# Altium project Quectel M66.PrjPcb
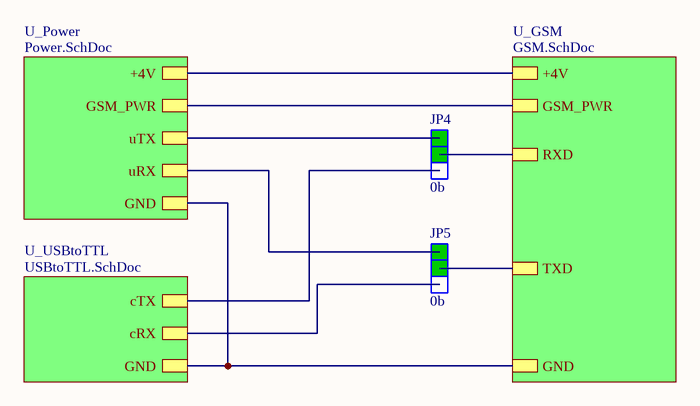
[diagram p0: Main.SchDoc]
Revision: 1.2; Project_Name: Quectel M66; CompanyName: github.com/aKaReZa75
4 sheets, 88 parts. Net scope: strictly hierarchical (ports join the sheet entries above them; power ports are local).
Board file: PCB.PcbDoc
Sheets:
  Main.SchDoc
    U_Power = Power.SchDoc
    U_GSM = GSM.SchDoc
    U_USBtoTTL = USBtoTTL.SchDoc

## Sheet Main.SchDoc: Main
size A4; SheetNumber: 2; SheetTotal: 4

### Parts
JP4  0b  [jumper selector]
JP5  0b  [jumper selector]

### Sub-sheets
U_GSM = GSM.SchDoc: +4V, GND, GSM_PWR, TXD, RXD
U_Power = Power.SchDoc: uRX, uTX, +4V, GND, GSM_PWR
U_USBtoTTL = USBtoTTL.SchDoc: GND, cTX, cRX

### Nets
+4: sheet U_Power/+4V, sheet U_GSM/+4V
GND: sheet U_Power/GND, sheet U_GSM/GND, sheet U_USBtoTTL/GND
cRX: JP5.3 ; sheet U_USBtoTTL/cRX
cTX: JP4.3 ; sheet U_USBtoTTL/cTX
GSM_PWR: sheet U_Power/GSM_PWR, sheet U_GSM/GSM_PWR
RXD: JP4.2 ; sheet U_GSM/RXD
TXD: JP5.2 ; sheet U_GSM/TXD
uRX: JP5.1 ; sheet U_Power/uRX
uTX: JP4.1 ; sheet U_Power/uTX

### Notes on the sheet
- Title:
- Project:
- Drawn by:
- Revision:
- Hossein Bagheri
- Company:
- Sheet
- of

### Library data of the parts
JP4 JP5 = SW_Other_JSelector_THT: Jumper Selector; Rating: Rating?; Inflow: 5145; Validation: Valid; Package: Dip; Type: Selector; Value: 0b

## Sheet Power.SchDoc: Power
size A4; SheetNumber: 3; SheetTotal: 4
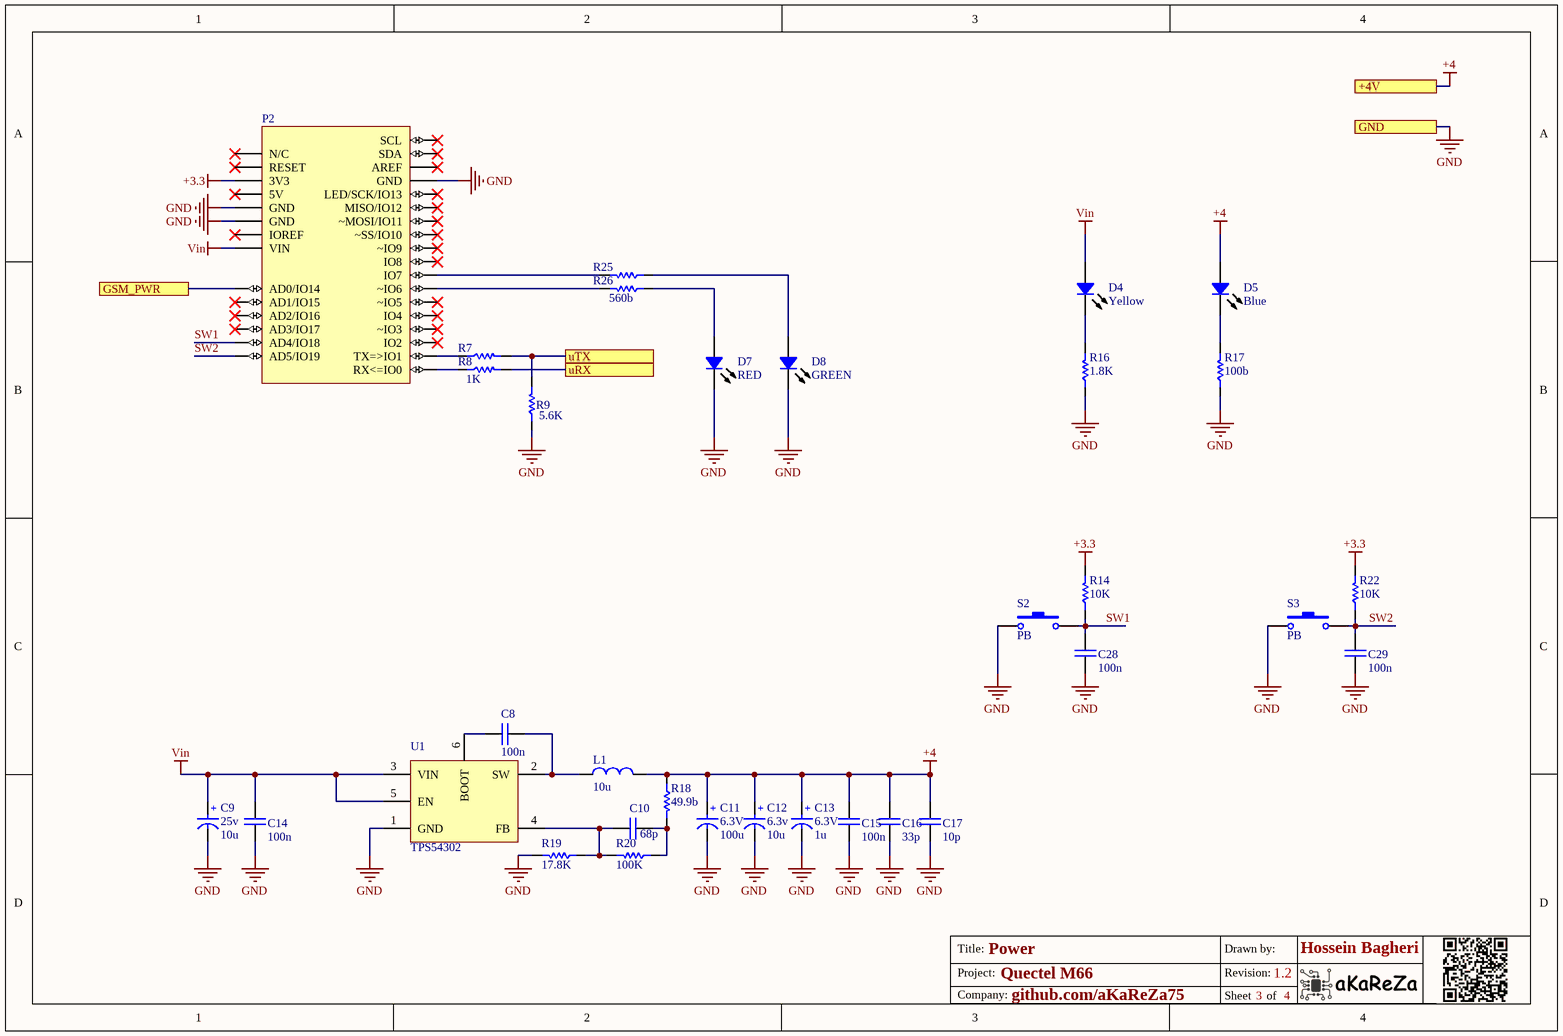
[diagram p1: Power.SchDoc]

### Parts
C8  100n  [CAP 0805/2012]
C9  Rating: 25v  [SMT_C_Tantalum_B]  (hidden comment: 10u)
C10  68p  [CAP 0805/2012]
C11  Rating: 6.3V  [SMT_C_Tantalum_C]  (hidden comment: 100u)
C12  Rating: 6.3v  [SMT_C_Tantalum_A]  (hidden comment: 10u)
C13  Rating: 6.3V  [SMT_C_Tantalum_A]  (hidden comment: 1u)
C14  100n  [CAP 1206/3216]
C15  100n  [CAP 1206/3216]
C16  33p  [CAP 1206/3216]
C17  10p  [CAP 1206/3216]
C28  100n  [CAP 0805/2012]
C29  100n  [CAP 0805/2012]
D4  Yellow  [LED 0805/2012 YELLOW]
D5  Blue  [LED 0805/2012 BLUE]
D7  RED  [LED 0805/2012 RED]
D8  GREEN  [LED 0805/2012 GREEN]
L1  10u  [L_7]
P2  UNO  [Arduino_uno_S_3]  (value not drawn)  (no BOM)
R7  1K  [RES 0805 (2012X06L)]  (value not drawn)
R8  1K  [RES 0805 (2012X06L)]
R9  5.6K  [RES 0805 (2012X06L)]
R14  10K  [RES 0805 (2012X06L)]
R16  1.8K  [RES 0805 (2012X06L)]
R17  100b  [RES 0805 (2012X06L)]
R18  49.9b  [RES 0805 (2012X06L)]
R19  17.8K  [RES 0805 (2012X06L)]
R20  100K  [RES 0805 (2012X06L)]
R22  10K  [RES 0805 (2012X06L)]
R25  560b  [RES 0805 (2012X06L)]  (value not drawn)
R26  560b  [RES 0805 (2012X06L)]
S2  PB  [SW_PB_SMD_2PIN_SPST_6X3X2]
S3  PB  [SW_PB_SMD_2PIN_SPST_6X3X2]
U1  TPS54302  [TPS54302]

### Ports
+4V, GND, GSM_PWR, uRX, uTX

### Nets
+3.3: P2.4(3V3) R14.2 R22.2
+4: C11.1(+) C12.1(+) C13.1(+) C15.1 C16.1 C17.1 D5.1 L1.2 R18.1 ; port +4V
GND: C9.2(-) C11.2(-) C12.2(-) C13.2(-) C14.2 C15.2 C16.2 C17.2 C28.2 C29.2 D7.2 D8.2 P2.6(GND) P2.7(GND) P2.29(GND) R9.1 R16.1 R17.1 R19.2 S2.2 S3.2 U1.1(GND) ; port GND
Vin: C9.1(+) C14.1 D4.1 P2.8(VIN) U1.3(VIN) U1.5(EN)
GSM_PWR: P2.9(AD0/IO14) ; port GSM_PWR
SW1: C28.1 P2.13(AD4/IO18) R14.1 S2.1
SW2: C29.1 P2.14(AD5/IO19) R22.1 S3.1
uRX: R8.2 ; port uRX
uTX: R7.2 R9.2 ; port uTX
NetC8_1: C8.1 U1.6(BOOT)
NetC8_2: C8.2 L1.1 U1.2(SW)
NetC10_1: C10.1 R19.1 R20.2 U1.4(FB)
NetC10_2: C10.2 R18.2 R20.1
NetD4_2: D4.2 R16.2
NetD5_2: D5.2 R17.2
NetD7_1: D7.1 R26.1
NetD8_1: D8.1 R25.1
NetP2_15: P2.15(RX<=IO0) R8.1
NetP2_16: P2.16(TX=>IO1) R7.1
NetP2_21: P2.21(~IO6) R26.2
NetP2_22: P2.22(IO7) R25.2

Not connected (* = marked no-connect by the designer): P2 1(N/C)* 2(IOREF)* 3(RESET)* 5(5V)* 10(AD1/IO15)* 11(AD2/IO16)* 12(AD3/IO17)* 17(IO2)* 18(~IO3)* 19(IO4)* 20(~IO5)* 23(IO8)* 24(~IO9)* 25(~SS/IO10)* 26(~MOSI/IO11)* 27(MISO/IO12)* 28(LED/SCK/IO13)* 30(AREF)* 31(SDA)* 32(SCL)*

### Notes on the sheet
- Title:
- Project:
- Drawn by:
- Revision:
- Hossein Bagheri
- Company:
- Sheet
- of

### Library data of the parts
C8 C28 C29 = Cap_Multi_SMD_100nF_0805: Bipolar ceramic capacitor SMD; Inflow: inflow?; Type: MultiLayer; Rating: 50V; Validation: Valid; Package: 0805; Value: 100n
C9 C12 = Cap_Tantalum: Tantalum Capacitor,TAJ Series-SMD; Inflow: inflow?; Validation: Valid; Package: Package?; Type: Tantalum; Value: 10u
C10 = Cap_Multi_SMD_0805: Bipolar ceramic capacitor SMD; Inflow: inflow?; Type: MultiLayer; Rating: Rating?; Validation: Valid; Package: 0805; Value: 68p
C11 C13 = Cap_Tantalum: Tantalum Capacitor,TAJ Series-SMD; Inflow: inflow?; Type: Tantalum
  C11: Package: SMD-C; Value: 100u
  C13: Package: SMD-A; Value: 1u
C14 = Cap_Multi_SMD_100nF_1206: Bipolar ceramic capacitor SMD; Type: MultiLayer; Inflow: inflow?; Rating: 50V; Validation: Valid; Package: 1206; Value: 100n
C15 = Cap_Multi_SMD_100nF_1206: Bipolar ceramic capacitor SMD; Type: MultiLayer; Inflow: inflow?; Rating: 50V; Package: 1206; Value: 100n
C16 C17 = Cap_Multi_SMD_1206: Bipolar ceramic capacitor SMD; Inflow: inflow?; Type: MultiLayer; Rating: 50V; Package: 1206
  C16: Value: 33p
  C17: Value: 10p
D4 D5 D7 D8 = Semi_LED_SMD: LED; Inflow: inflow?; Rating: Rating?; Validation: Valid; Package: Package?; Type: LED
  D4: Value: Yellow
  D5: Value: Blue
  D7: Value: RED
  D8: Value: GREEN
L1 = Ind_SMD: Inductor; Inflow: inflow?; Type: Type?; Rating: 3.8A; Validation: Valid; Package: Package?; Value: 10u
P2 = Con_Arduino_UNO_S: Arduino uno slave; Inflow: inflow?; Rating: Rating?; Validation: Valid; Value: UNO; Package: Package?; Type: Type?
R7-R9 R14 R16-R20 R22 R25 R26 = Res_SMD_0805: Resistor; Inflow: inflow?; Rating: 0.125W; Validation: Valid; Package: 0805
  R7 R8: Type: 10%; Value: 1K
  R9: Type: 10%; Value: 5.6K
  R14 R22: Type: 10%; Value: 10K
  R16: Type: 10%; Value: 1.8K
  R17: Type: 10%; Value: 100b
  R18: Type: 1%; Value: 49.9b
  R19: Type: 1%; Value: 17.8K
  R20: Type: 1%; Value: 100K
  R25 R26: Type: 10%; Value: 560b
S2 S3 = SW_PushButton_2_SMD: SMT Tactile ‎Switch; Rating: 2b; Validation: Valid; Inflow: 8260; Type: Vertical; Package: SMD; Value: PB
U1 = IC_Reg_TPS54302: 3'A Synchronous Step-Down Converter; Rating: S; Inflow: inflow?; Validation: Valid; Value: TPS54302; Type: Switching; Package: SOT-23-6

## Sheet GSM.SchDoc: GSM
size A4; SheetNumber: 2; SheetTotal: 4
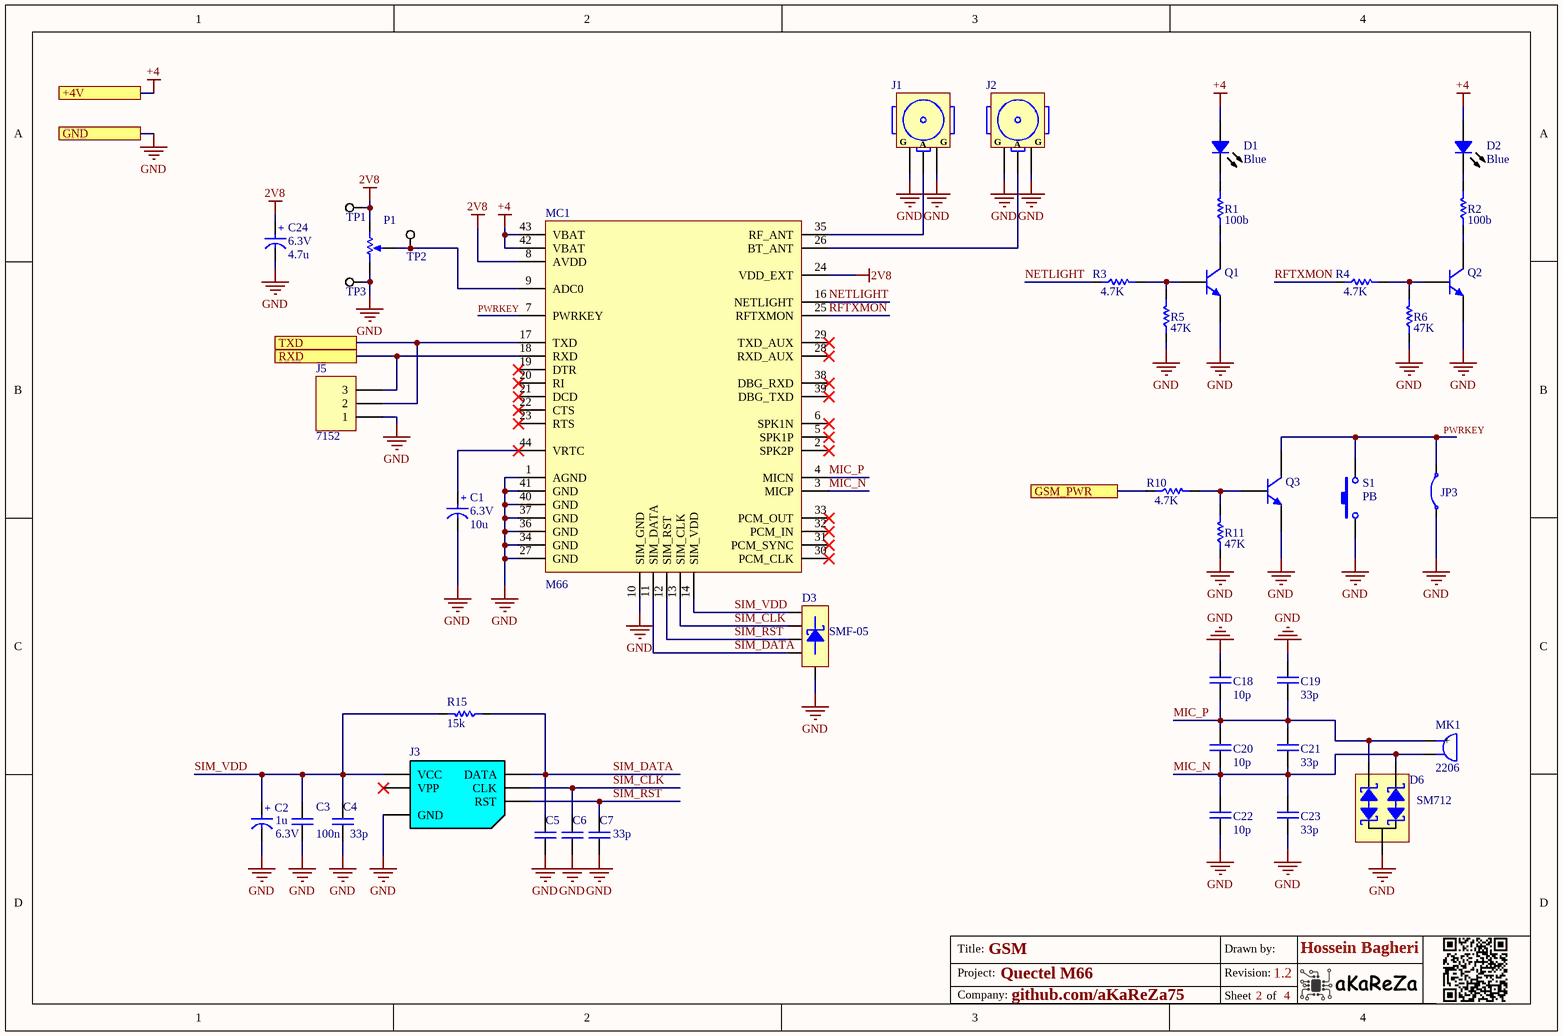
[diagram p2: GSM.SchDoc]

### Parts
C1  Rating: 6.3V  [SMT_C_Tantalum_A]  (hidden comment: 10u)
C2  Rating: 6.3V  [SMT_C_Tantalum_A]  (hidden comment: 1u)
C3  100n  [CAP 0805/2012]
C4  33p  [CAP 0805/2012]
C5  33p  [CAP 0805/2012]  (value not drawn)
C6  33p  [CAP 0805/2012]  (value not drawn)
C7  33p  [CAP 0805/2012]
C18  10p  [CAP 0603/1608]
C19  33p  [CAP 0603/1608]
C20  10p  [CAP 0603/1608]
C21  33p  [CAP 0603/1608]
C22  10p  [CAP 0603/1608]
C23  33p  [CAP 0603/1608]
C24  Rating: 6.3V  [SMT_C_Tantalum_A]  (hidden comment: 4.7u)
D1  Blue  [LED 0805/2012 BLUE]
D2  Blue  [LED 0805/2012 BLUE]
D3  SMF-05  [SC70-5_N]
D6  SM712  [SOT23_M]
J1  U.FL  [IPEX-3x3mm]  (value not drawn)
J2  U.FL  [IPEX-3x3mm]  (value not drawn)
J3  6'Pin  [GCT_SIM8051_Plastik]  (value not drawn)
J5  Inflow: 7152  [HDR_THT_3M_2.54mm]  (hidden comment: 3)
JP3  Jumper  [RESC2012M (0805)]  (value not drawn)
MC1  M66  [m66]
MK1  Inflow: 2206  [mic6]  (hidden comment: Mic)
P1  10K  [Multi turn 01]  (value not drawn)
Q1  NPN  [SOT23_N]  (value not drawn)
Q2  NPN  [SOT23_N]  (value not drawn)
Q3  NPN  [SOT23_N]  (value not drawn)
R1  100b  [RES 0805 (2012X06L)]
R2  100b  [RES 0805 (2012X06L)]
R3  4.7K  [RES 0805 (2012X06L)]
R4  4.7K  [RES 0805 (2012X06L)]
R5  47K  [RES 0805 (2012X06L)]
R6  47K  [RES 0805 (2012X06L)]
R10  4.7K  [RES 0805 (2012X06L)]
R11  47K  [RES 0805 (2012X06L)]
R15  15k  [RES 0805 (2012X06L)]
S1  PB  [SW_PB_SMD_2PIN_SPST_6X3X2]
TP1  TestPoint  [TP_SMD_1x2]  (value not drawn)  (no BOM)
TP2  TestPoint  [TP_SMD_1x2]  (value not drawn)  (no BOM)
TP3  TestPoint  [TP_SMD_1x2]  (value not drawn)  (no BOM)

### Ports
+4V, GND, GSM_PWR, RXD, TXD

### Nets
2V8: C24.1(+) MC1.8(AVDD) MC1.24(VDD_EXT) P1.3 TP1.1(TP)
+4: D1.1 D2.1 MC1.42(VBAT) MC1.43(VBAT) ; port +4V
GND: C1.2(-) C2.2(-) C3.2 C4.2 C5.2 C6.2 C7.2 C18.1 C19.1 C22.2 C23.2 C24.2(-) D3.2(K) D6.3 J1.2(G) J1.3(G) J2.2(G) J2.3(G) J3.5(GND) J5.1 JP3.1 MC1.1(AGND) MC1.10(SIM_GND) MC1.27(GND) MC1.34(GND) MC1.36(GND) MC1.37(GND) MC1.40(GND) MC1.41(GND) P1.1 Q1.2(E) Q2.2(E) Q3.2(E) R5.1 R6.1 R11.1 S1.1 TP3.1(TP) ; port GND
GSM_PWR: R10.1 ; port GSM_PWR
MIC_N: C20.2 C21.2 C22.1 C23.1 D6.2 MC1.3(MICP) MK1.2
MIC_P: C18.2 C19.2 C20.1 C21.1 D6.1 MC1.4(MICN) MK1.1(+)
NETLIGHT: MC1.16(NETLIGHT) R3.1
PWRKEY: JP3.2 MC1.7(PWRKEY) Q3.3(C) S1.2
RFTXMON: MC1.25(RFTXMON) R4.1
RXD: J5.3 MC1.18(RXD) ; port RXD
SIM_CLK: C6.1 D3.4(K) J3.3(CLK) MC1.13(SIM_CLK)
SIM_DATA: C5.1 D3.5(K) J3.4(DATA) MC1.11(SIM_DATA) R15.1
SIM_RST: C7.1 D3.1(K) J3.2(RST) MC1.12(SIM_RST)
SIM_VDD: C2.1(+) C3.1 C4.1 D3.3(K) J3.1(VCC) MC1.14(SIM_VDD) R15.2
TXD: J5.2 MC1.17(TXD) ; port TXD
NetC1_1: C1.1(+) MC1.44(VRTC)
NetD1_2: D1.2 R1.2
NetD2_2: D2.2 R2.2
NetJ1_1: J1.1(A) MC1.35(RF_ANT)
NetJ2_1: J2.1(A) MC1.26(BT_ANT)
NetMC1_9: MC1.9(ADC0) P1.2 TP2.1(TP)
NetQ1_1: Q1.1(B) R3.2 R5.2
NetQ1_3: Q1.3(C) R1.1
NetQ2_1: Q2.1(B) R4.2 R6.2
NetQ2_3: Q2.3(C) R2.1
NetQ3_1: Q3.1(B) R10.2 R11.2

Not connected (* = marked no-connect by the designer): J3 6(VPP)*; MC1 2(SPK2P)* 5(SPK1P)* 6(SPK1N)* 19(DTR)* 20(RI)* 21(DCD)* 22(CTS)* 23(RTS)* 28(RXD_AUX)* 29(TXD_AUX)* 30(PCM_CLK)* 31(PCM_SYNC)* 32(PCM_IN)* 33(PCM_OUT)* 38(DBG_RXD)* 39(DBG_TXD)*

### Notes on the sheet
- Title:
- Project:
- Drawn by:
- Revision:
- Hossein Bagheri
- Company:
- Sheet
- of

### Library data of the parts
C1 C2 C24 = Cap_Tantalum: as C9 on sheet Power; Package: Package?; Type: Tantalum
  C1: Value: 10u
  C2: Value: 1u
  C24: Value: 4.7u
C3 = Cap_Multi_SMD_100nF_0805: as C8 on sheet Power; Package: 0805; Value: 100n
C4-C7 = Cap_Multi_SMD_0805: as C10 on sheet Power; Package: 0805; Value: 33p
C18-C23 = Cap_Multi_SMD: Bipolar ceramic capacitor SMD; Inflow: inflow?; Type: Type?; Validation: Valid; Rating: Rating?; Package: Package?
  C18 C20 C22: Value: 10p
  C19 C21 C23: Value: 33p
D1 D2 = Semi_LED_SMD: as D4 on sheet Power; Package: Package?; Type: LED; Value: Blue
D3 = Semi_Diod_TVS_SMF05: TVS Diode Array; Rating: Rating?; Validation: Valid; Inflow: inflow?; Type: TVS; Value: SMF-05; Package: SC70-5
D6 = Semi_Diod_TVS_SM712: TVS, ESD PROTECT, 2CH, 400W/17A PP, 7.5VBR, ±8KV ESDmin; Rating: Rating?; Type: Type?; Validation: Valid; Inflow: inflow?; Value: SM712; Package: Package?
J1 J2 = Con_RF_U.FL: Rating: Rating?; Inflow: inflow?; Validation: NT; Type: RF; Package: SMD; Value: U.FL
J3 = Con_Socket_SimCard_1: Nano SimCard Holder 6P; Rating: Rating?; Validation: Valid; Inflow: inflow?; Package: SMD; Type: Nano; Value: 6'Pin
J5 = Con_MPH_3x1_V_THT_2.54: Header, single row, 3 pin; Rating: Rating?; Validation: NT; Value: 3; Package: Package?; Type: Type?
JP3 = Other_Elec_Jumper_0805: Jumper Component; Rating: Rating?; Inflow: inflow?; Validation: Valid; Type: Type?; Package: 0805; Value: Jumper
MC1 = ModSen_Com_M66: Quectel GSM/GPRS Module; Rating: Rating?; Validation: Valid; Inflow: inflow?; Package: Dip; Value: M66; Type: GSM-GPRS
MK1 = Other_Elec_Microphone: Microphone; Rating: Rating?; Validation: NT; Value: Mic; Package: Package?; Type: Type?
P1 = Res_Multi: Multi Turn; Rating: Rating?; Validation: Valid; Inflow: inflow?; Package: Package?; Type: Type?; Value: 10K
Q1-Q3 = Semi_BJT_BC817: NPN General purpose Transistor; Rating: Rating?; Type: Type?; Validation: Valid; Inflow: inflow?; Value: NPN; Package: Package?
R1-R6 R10 R11 R15 = Res_SMD_0805: as R7 on sheet Power; Package: 0805; Type: 10%
  R1 R2: Value: 100b
  R3 R4 R10: Value: 4.7K
  R5 R6 R11: Value: 47K
  R15: Value: 15k
S1 = SW_PushButton_2_SMD: as S2 on sheet Power; Type: Vertical; Package: SMD; Value: PB
TP1-TP3 = Other_Elec_TP_SMD: Test Point; Rating: Rating?; Validation: NT; Inflow: inflow?; Value: TestPoint; Package: Package?; Type: Type?

## Sheet USBtoTTL.SchDoc: USB to TTL
size A4; SheetNumber: 4; SheetTotal: 4
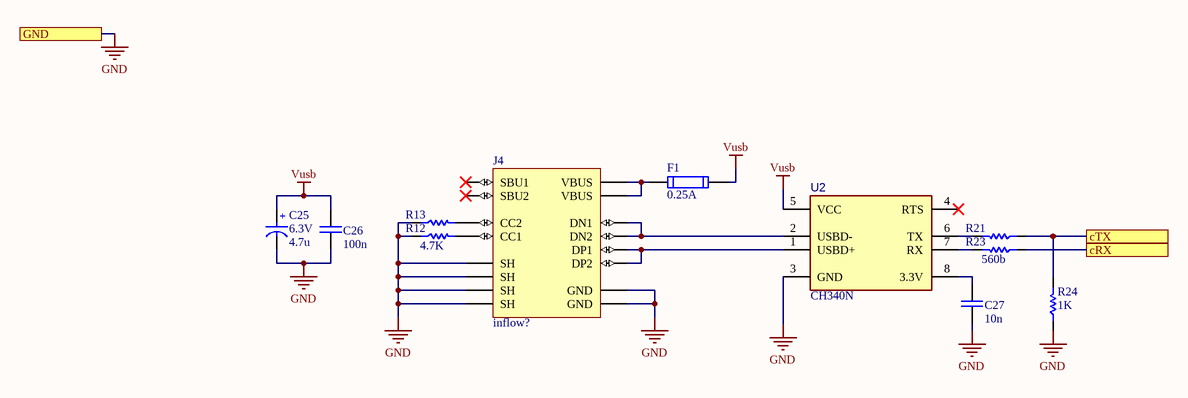
[diagram p3: USBtoTTL.SchDoc]

### Parts
C25  value 4.7u  Rating: 6.3V  [SMT_C_Tantalum_A]  (hidden comment: DS1307)
C26  value 100n  [CAP 0805/2012]  (hidden comment: DS1307)
C27  10n  [CAP 0805/2012]
F1  0.25A  [1206_F]
J4  Inflow: inflow?  [USBC_SMD_16_USB4110 - Extended]  (hidden comment: 16b)
R12  4.7K  [RES 0805 (2012X06L)]
R13  4.7K  [RES 0805 (2012X06L)]  (value not drawn)
R21  560b  [RES 0805 (2012X06L)]  (value not drawn)
R23  560b  [RES 0805 (2012X06L)]
R24  1K  [RES 0805 (2012X06L)]
U2  CH340N  [SO8_narrow_m]

### Ports
cRX, cTX, GND

### Nets
GND: C25.2(-) C26.2 C27.2 J4.A1B12(GND) J4.B1A12(GND) J4.S1(SH) J4.S2(SH) J4.S3(SH) J4.S4(SH) R12.1 R13.1 R24.1 U2.3(GND) ; port GND
Vusb: C25.1(+) C26.1 F1.2 U2.5(VCC)
cRX: R23.1 ; port cRX
cTX: R21.1 R24.2 ; port cTX
NetC27_1: C27.1 U2.8(3.3V)
NetF1_1: F1.1 J4.A4B9(VBUS) J4.B4A9(VBUS)
NetJ4_A5: J4.A5(CC1) R12.2
NetJ4_A6: J4.A6(DP1) J4.B6(DP2) U2.1(USBD+)
NetJ4_A7: J4.A7(DN1) J4.B7(DN2) U2.2(USBD-)
NetJ4_B5: J4.B5(CC2) R13.2
NetR21_2: R21.2 U2.6(TX)
NetR23_2: R23.2 U2.7(RX)

Not connected (* = marked no-connect by the designer): J4 A8(SBU1)* B8(SBU2)*; U2 4(RTS)*

### Notes on the sheet
- Title:
- Project:
- Drawn by:
- Revision:
- Hossein Bagheri
- Company:
- Sheet
- of

### Library data of the parts
C25 = Cap_Tantalum: as C11 on sheet Power; Package: SMD-A; Type: Tantalum
C26 C27 = Cap_Multi_SMD_100nF_0805: Bipolar ceramic capacitor SMD; Inflow: inflow?; Type: MultiLayer; Rating: 50V; Package: 0805
  C27: Value: 10n
F1 = Other_Elec_Fuse_SMD: Short circiut  protection; Inflow: 0.5A; Type: Fast; Rating: Rating?; Package: 1206; Value: 0.25A
J4 = Con_USB_C_16P: USB C Female Connector; Rating: Rating?; Validation: NT; Value: 16b; Package: SMD; Type: C
R12 R13 R21 R23 R24 = Res_SMD_0805: Resistor; Inflow: inflow?; Rating: 0.125W; Package: 0805; Type: 10%
  R12 R13: Value: 4.7K
  R21 R23: Value: 560b
  R24: Value: 1K
U2 = IC_Converter_CH340N: TTL To USB Chip; Rating: Rating?; Inflow: inflow?; Type: USB to TTL; Package: SO-8; Value: CH340N

## Nets that join several sheets
+4: Power (9 pins), GSM (D1.1 D2.1 MC1.42 MC1.43)
GND: Power (22 pins), GSM (38 pins), USBtoTTL (13 pins)
cRX: Main (JP5.3), USBtoTTL (R23.1)
cTX: Main (JP4.3), USBtoTTL (R21.1 R24.2)
GSM_PWR: Power (P2.9), GSM (R10.1)
RXD: Main (JP4.2), GSM (J5.3 MC1.18)
TXD: Main (JP5.2), GSM (J5.2 MC1.17)
uRX: Main (JP5.1), Power (R8.2)
uTX: Main (JP4.1), Power (R7.2 R9.2)